# Altium schematic sheet FPGA.SchDoc
size D; SheetNumber: 1; SheetTotal: 1
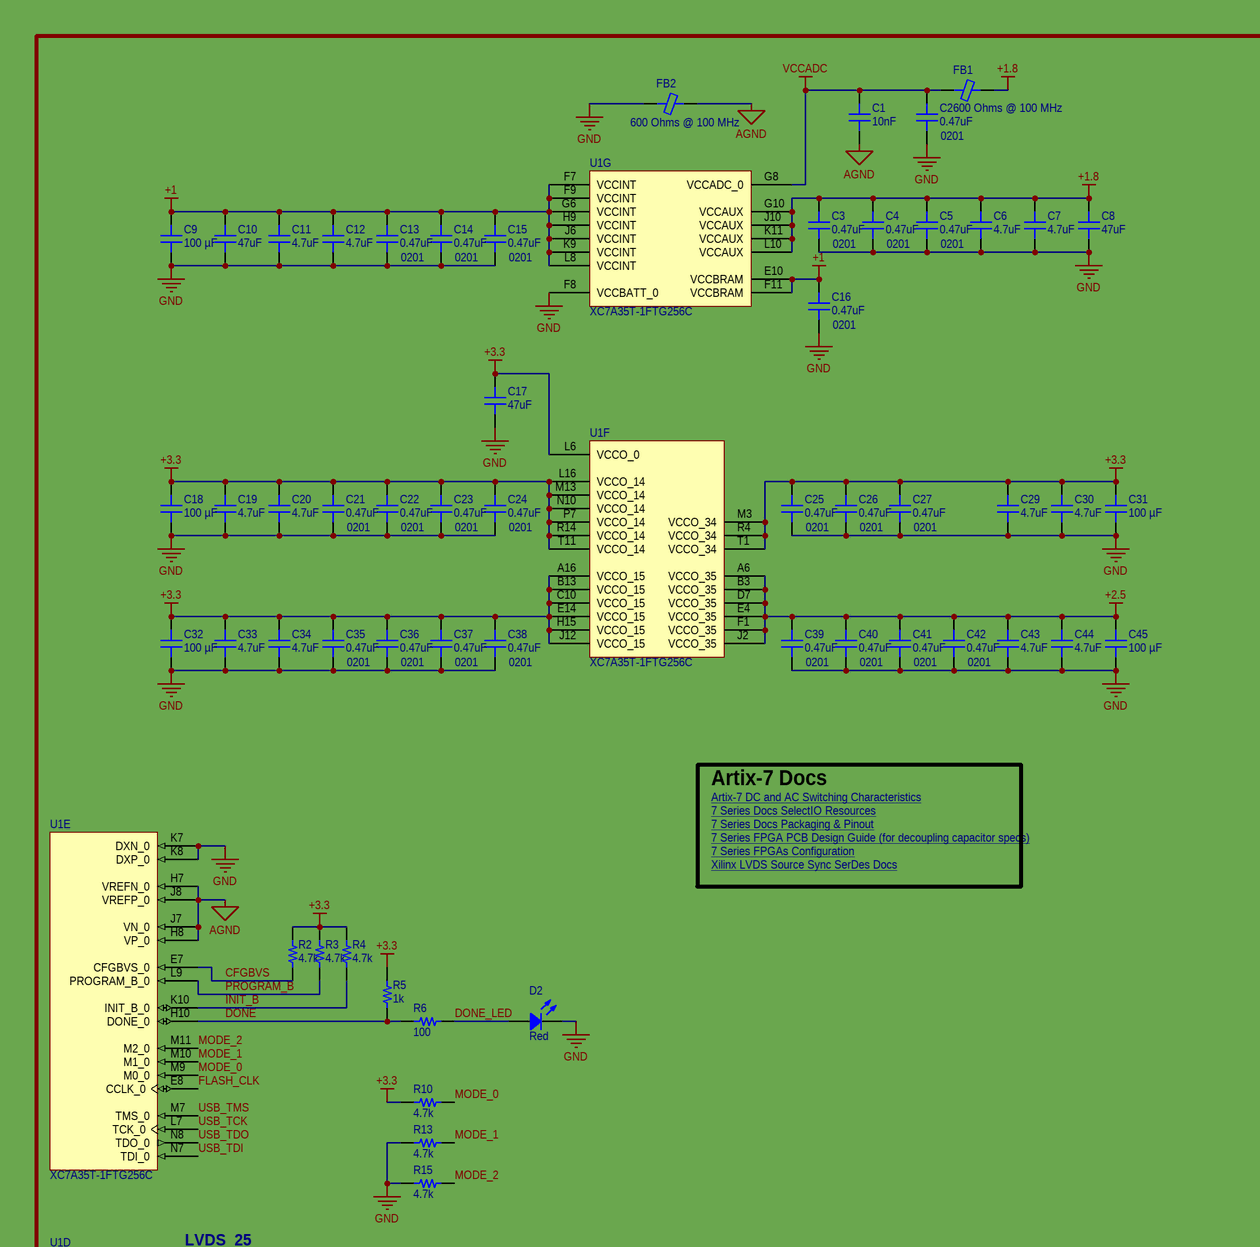
[diagram p0: FPGA.SchDoc, top left]
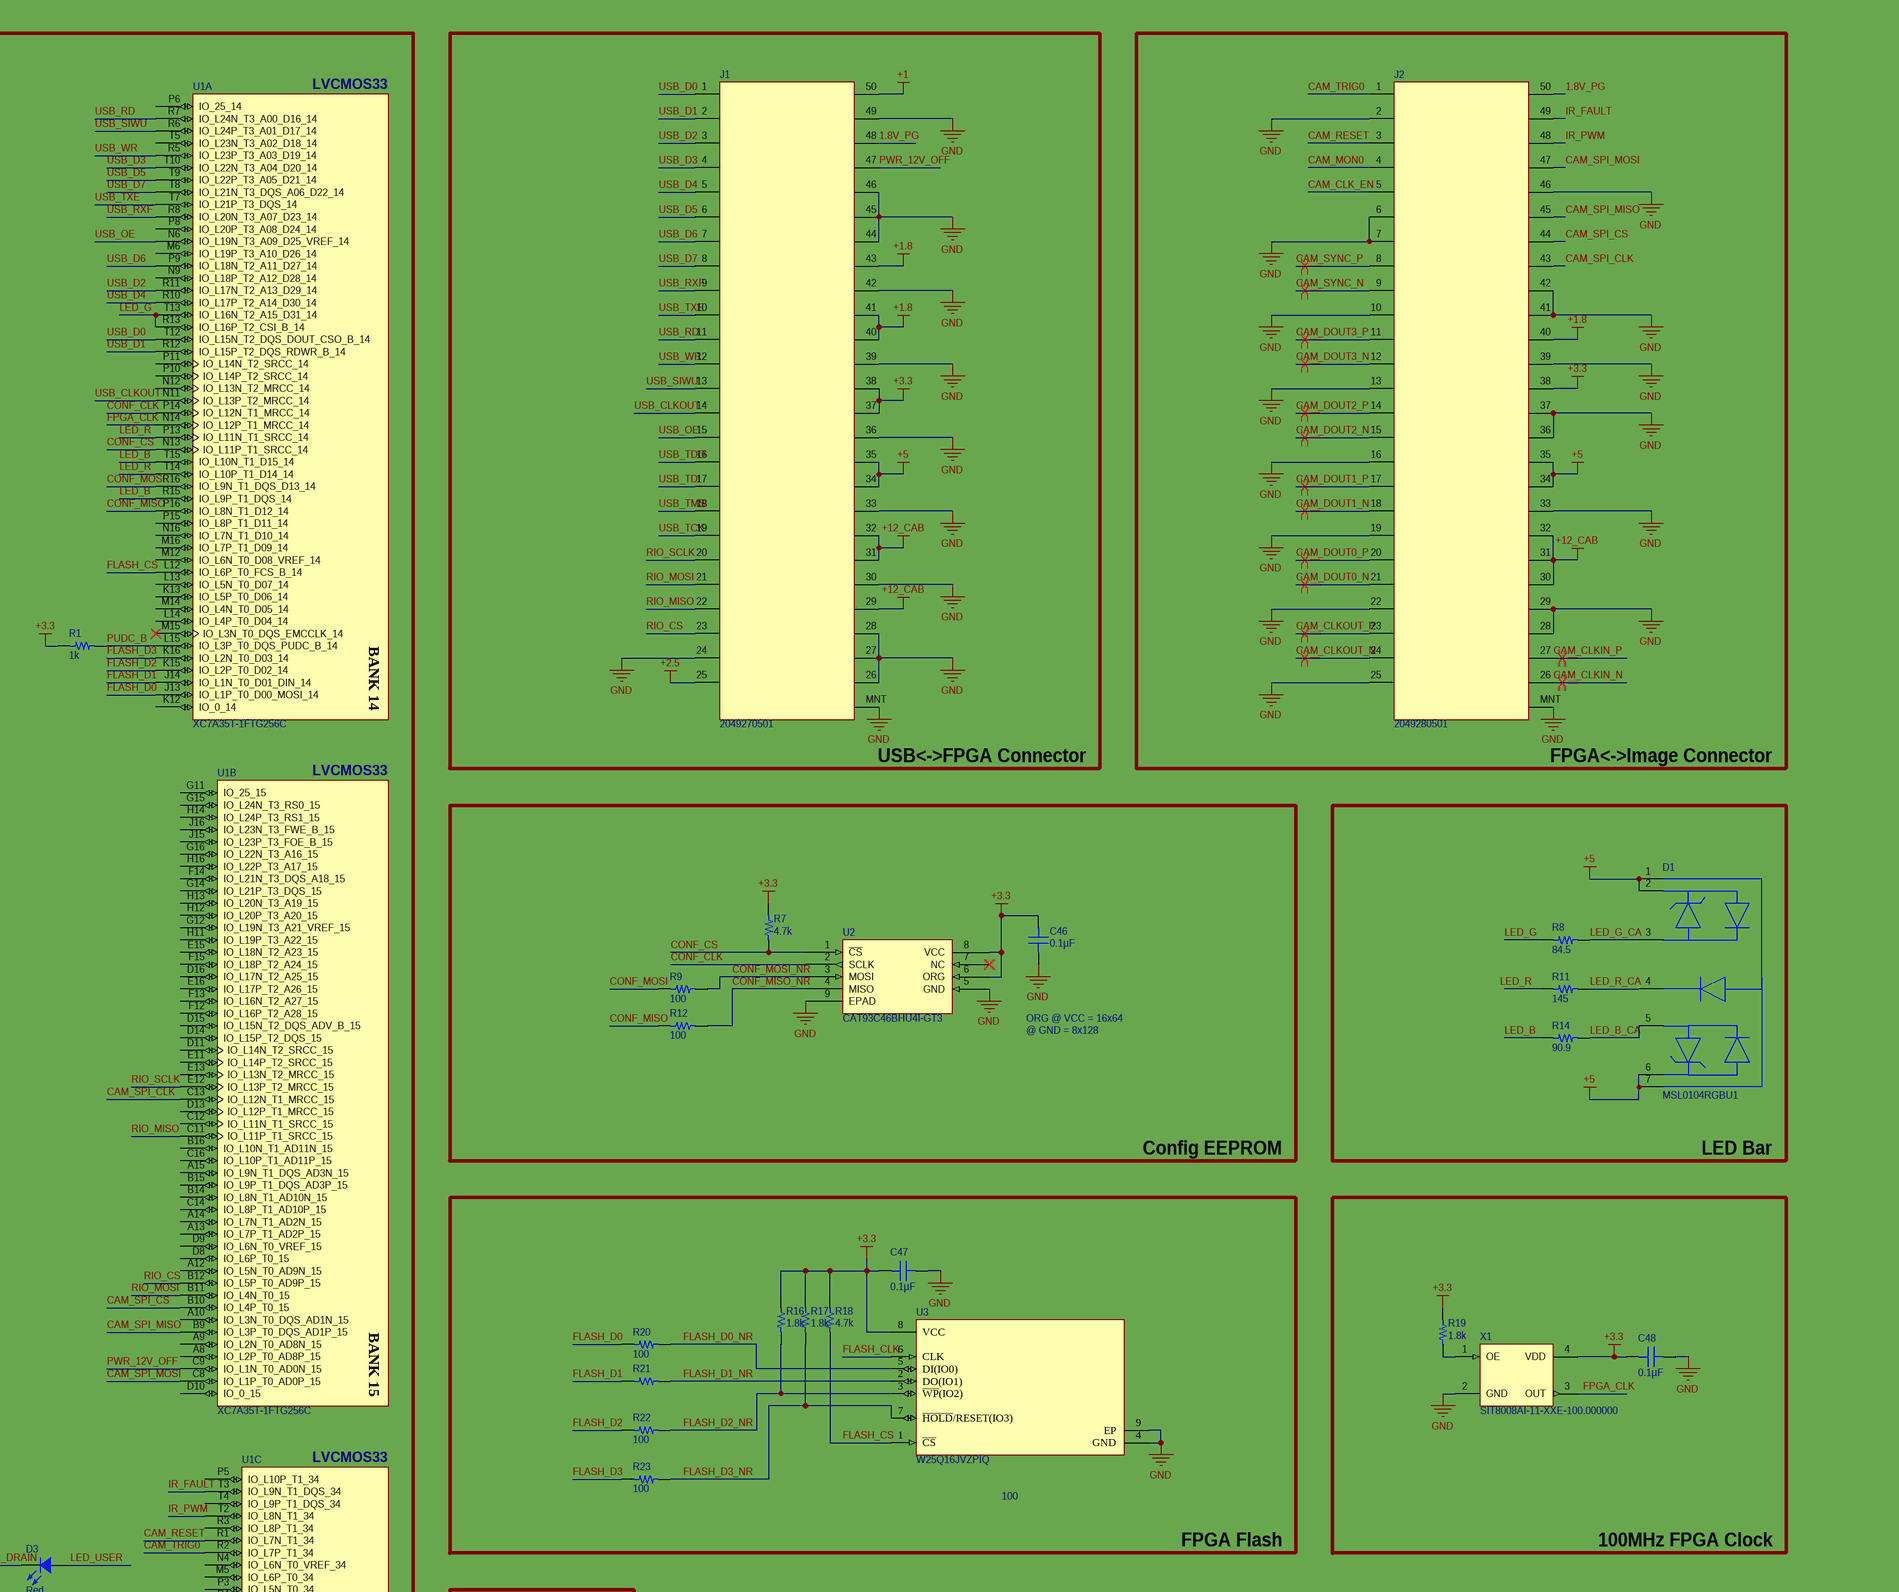
[diagram p1: FPGA.SchDoc, top middle]
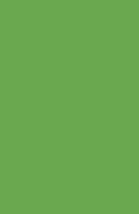
[diagram p2: FPGA.SchDoc, top right]
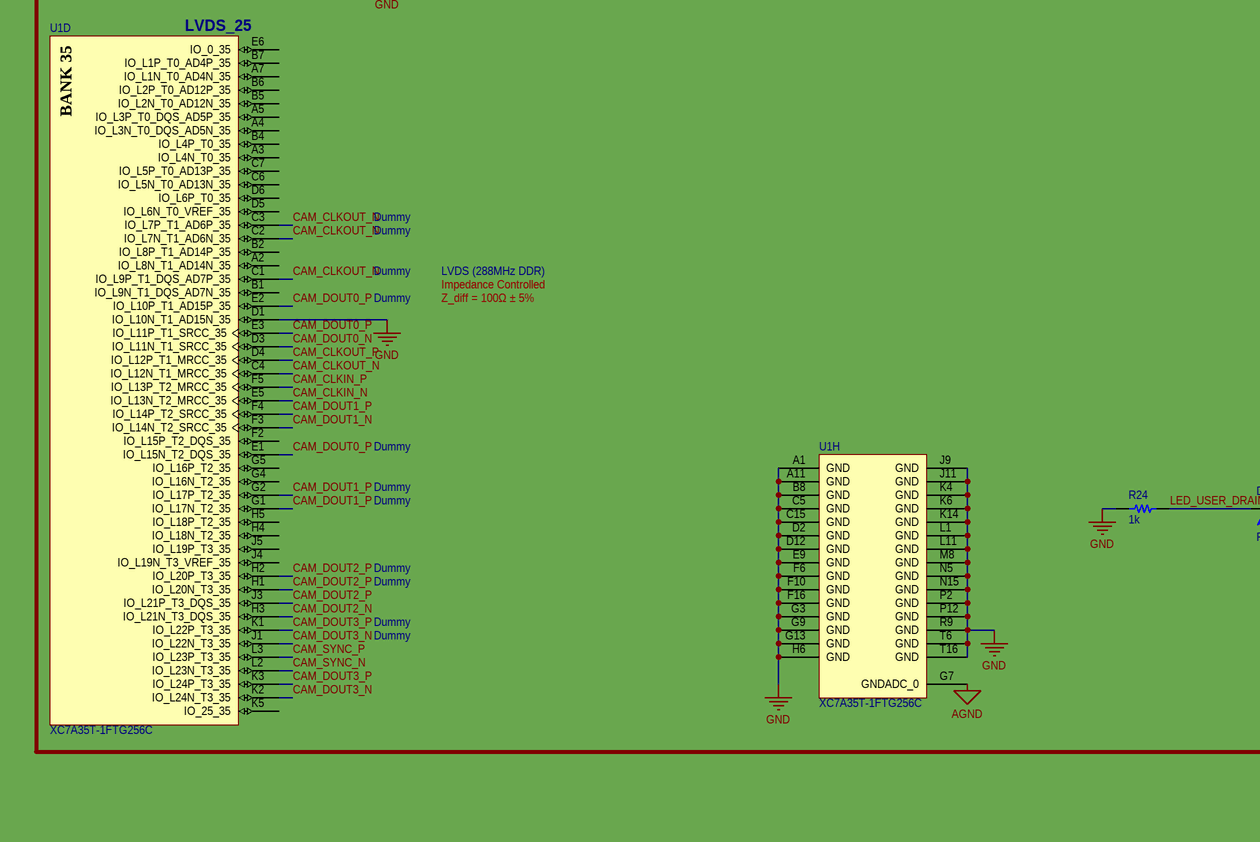
[diagram p3: FPGA.SchDoc, bottom left]
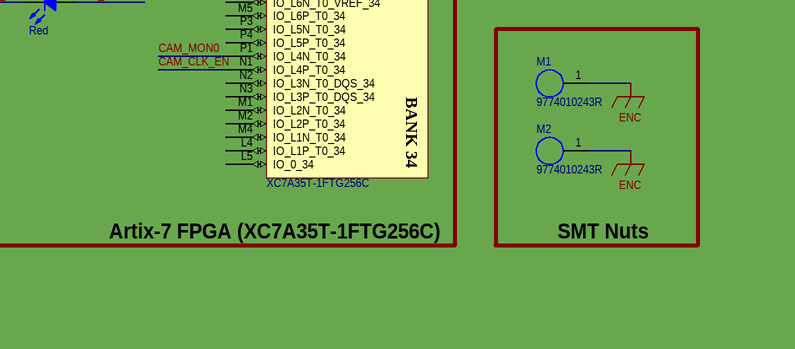
[diagram p4: FPGA.SchDoc, bottom middle]
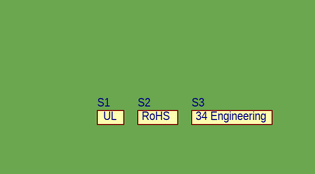
[diagram p5: FPGA.SchDoc, bottom right]

## Parts
C1  10nF  [CAP 0402_1005]
C2  0.47uF  Package / Case: 0201  [CAP 0201_0603]
C3  0.47uF  Package / Case: 0201  [CAP 0201_0603]
C4  0.47uF  Package / Case: 0201  [CAP 0201_0603]
C5  0.47uF  Package / Case: 0201  [CAP 0201_0603]
C6  4.7uF  [CAP 0402_1005]
C7  4.7uF  [CAP 0402_1005]
C8  47uF  [CAP 0603_1608]
C9  100 µF  [CAP 0805_2012]
C10  47uF  [CAP 0603_1608]
C11  4.7uF  [CAP 0402_1005]
C12  4.7uF  [CAP 0402_1005]
C13  0.47uF  Package / Case: 0201  [CAP 0201_0603]
C14  0.47uF  Package / Case: 0201  [CAP 0201_0603]
C15  0.47uF  Package / Case: 0201  [CAP 0201_0603]
C16  0.47uF  Package / Case: 0201  [CAP 0201_0603]
C17  47uF  [CAP 0603_1608]
C18  100 µF  [CAP 0805_2012]
C19  4.7uF  [CAP 0402_1005]
C20  4.7uF  [CAP 0402_1005]
C21  0.47uF  Package / Case: 0201  [CAP 0201_0603]
C22  0.47uF  Package / Case: 0201  [CAP 0201_0603]
C23  0.47uF  Package / Case: 0201  [CAP 0201_0603]
C24  0.47uF  Package / Case: 0201  [CAP 0201_0603]
C25  0.47uF  Package / Case: 0201  [CAP 0201_0603]
C26  0.47uF  Package / Case: 0201  [CAP 0201_0603]
C27  0.47uF  Package / Case: 0201  [CAP 0201_0603]
C29  4.7uF  [CAP 0402_1005]
C30  4.7uF  [CAP 0402_1005]
C31  100 µF  [CAP 0805_2012]
C32  100 µF  [CAP 0805_2012]
C33  4.7uF  [CAP 0402_1005]
C34  4.7uF  [CAP 0402_1005]
C35  0.47uF  Package / Case: 0201  [CAP 0201_0603]
C36  0.47uF  Package / Case: 0201  [CAP 0201_0603]
C37  0.47uF  Package / Case: 0201  [CAP 0201_0603]
C38  0.47uF  Package / Case: 0201  [CAP 0201_0603]
C39  0.47uF  Package / Case: 0201  [CAP 0201_0603]
C40  0.47uF  Package / Case: 0201  [CAP 0201_0603]
C41  0.47uF  Package / Case: 0201  [CAP 0201_0603]
C42  0.47uF  Package / Case: 0201  [CAP 0201_0603]
C43  4.7uF  [CAP 0402_1005]
C44  4.7uF  [CAP 0402_1005]
C45  100 µF  [CAP 0805_2012]
C46  0.1µF  [CAP 0402_1005]
C47  0.1µF  [CAP 0402_1005]
C48  0.1µF  [CAP 0402_1005]
D1  MSL0104RGBU1  [FP-MSL0104-MFG]
D2  Red  [LED 0603_1608 RED]
D3  Red  [LED 0603_1608 RED]
FB1  600 Ohms @ 100 MHz  [FER 0603_1608]
FB2  600 Ohms @ 100 MHz  [FER 0603_1608]
J1  2049270501  [2049270501]
J2  2049280501  [2049280501]
M1  9774010243R  [9774010243R]
M2  9774010243R  [9774010243R]
R1  1k  [RES 0402_1005]
R2  4.7k  [RES 0402_1005]
R3  4.7k  [RES 0402_1005]
R4  4.7k  [RES 0402_1005]
R5  1k  [RES 0402_1005]
R6  100  [RES 0402_1005]
R7  4.7k  [RES 0402_1005]
R8  84.5  [RES 0402_1005]
R9  100  [RES 0402_1005]
R10  4.7k  [RES 0402_1005]
R11  145  [RES 0402_1005]
R12  100  [RES 0402_1005]
R13  4.7k  [RES 0402_1005]
R14  90.9  [RES 0402_1005]
R15  4.7k  [RES 0402_1005]
R16  1.8k  [RES 0402_1005]
R17  1.8k  [RES 0402_1005]
R18  4.7k  [RES 0402_1005]
R19  1.8k  [RES 0402_1005]
R20  100  [RES 0402_1005]
R21  100  [RES 0402_1005]
R22  100  [RES 0402_1005]
R23  100  [RES 0402_1005]
R24  1k  [RES 0603_1608]
S1  (no value)  [UL]
S2  (no value)  [RoHS]
S3  (no value)  [34EngineeringLogo]
U1  XC7A35T-1FTG256C  [FTG256]  (parts A,B,C,D,E,F,G,H of 8)
U2  CAT93C46BHU4I-GT3  [CAT93C46BHU4I-GT3]
U3  W25Q16JVZPIQ  [FP-ZP-IPC_B]
X1  SIT8008AI-11-XXE-100.000000  [SIT8008AI-11-XXE-100.000000]

## Blocks framed on the sheet
USB<->FPGA Connector: J1
FPGA<->Image Connector: J2
Config EEPROM: C46 R7 R9 R12 U2
LED Bar: D1 R8 R11 R14
FPGA Flash: C47 R16-R18 R20-R23 U3
100MHz FPGA Clock: C48 R19 X1
SMT Nuts: M1 M2

## Nets
+1: C9.2 C10.2 C11.1 C12.1 C13.1 C14.1 C15.1 C16.2 J1.50 U1.E10(VCCBRAM) U1.F7(VCCINT) U1.F9(VCCINT) U1.F11(VCCBRAM) U1.G6(VCCINT) U1.H9(VCCINT) U1.J6(VCCINT) U1.K9(VCCINT) U1.L8(VCCINT)
+1.8: C3.2 C4.2 C5.2 C6.2 C7.2 C8.2 FB1.2 J1.40 J1.41 J1.43 J2.40 U1.G10(VCCAUX) U1.J10(VCCAUX) U1.K11(VCCAUX) U1.L10(VCCAUX)
+2.5: C39.2 C40.2 C41.2 C42.2 C43.2 C44.2 C45.2 J1.25 U1.A6(VCCO_35) U1.B3(VCCO_35) U1.D7(VCCO_35) U1.E4(VCCO_35) U1.F1(VCCO_35) U1.J2(VCCO_35)
+3.3: C17.2 C18.2 C19.1 C20.1 C21.1 C22.1 C23.1 C24.1 C25.2 C26.2 C27.2 C29.2 C30.2 C31.2 C32.2 C33.1 C34.1 C35.1 C36.1 C37.1 C38.1 C46.2 C47.2 C48.2 J1.37 J1.38 J2.38 R1.1 R2.2 R3.2 R4.2 R5.2 R7.2 R10.2 R16.2 R17.2 R18.2 R19.2 U1.A16(VCCO_15) U1.B13(VCCO_15) U1.C10(VCCO_15) U1.E14(VCCO_15) U1.H15(VCCO_15) U1.J12(VCCO_15) U1.L6(VCCO_0) U1.L16(VCCO_14) U1.M3(VCCO_34) U1.M13(VCCO_14) U1.N10(VCCO_14) U1.P7(VCCO_14) U1.R4(VCCO_34) U1.R14(VCCO_14) U1.T1(VCCO_34) U1.T11(VCCO_14) U2.6(ORG) U2.8(VCC) U3.8(VCC) X1.4(VDD)
+5: D1.1(R_A) D1.2(G_A) D1.6(B_A) D1.7(R_A) J1.34 J1.35 J2.34 J2.35
+12_CAB: J1.29 J1.31 J1.32 J2.30 J2.31 J2.32
AGND: C1.1 FB2.2 U1.G7(GNDADC_0) U1.H7(VREFN_0) U1.H8(VP_0) U1.J7(VN_0) U1.J8(VREFP_0)
ENC: M1.1 M2.1
GND: C2.1 C3.1 C4.1 C5.1 C6.1 C7.1 C8.1 C9.1 C10.1 C11.2 C12.2 C13.2 C14.2 C15.2 C16.1 C17.1 C18.1 C19.2 C20.2 C21.2 C22.2 C23.2 C24.2 C25.1 C26.1 C27.1 C29.1 C30.1 C31.1 C32.1 C33.2 C34.2 C35.2 C36.2 C37.2 C38.2 C39.1 C40.1 C41.1 C42.1 C43.1 C44.1 C45.1 C46.1 C47.1 C48.1 D2.2 FB2.1 J1.24 J1.26 J1.27 J1.28 J1.30 J1.33 J1.36 J1.39 J1.42 J1.44 J1.45 J1.46 J1.49 J1.MNT J2.2 J2.6 J2.7 J2.10 J2.13 J2.16 J2.19 J2.22 J2.25 J2.28 J2.29 J2.33 J2.36 J2.37 J2.39 J2.41 J2.42 J2.46 J2.MNT R13.2 R15.2 R24.2 U1.A1(GND) U1.A11(GND) U1.B8(GND) U1.C5(GND) U1.C15(GND) U1.D1(IO_L10N_T1_AD15N_35) U1.D2(GND) U1.D12(GND) U1.E9(GND) U1.F6(GND) U1.F8(VCCBATT_0) U1.F10(GND) U1.F16(GND) U1.G3(GND) U1.G9(GND) U1.G13(GND) U1.H6(GND) U1.J9(GND) U1.J11(GND) U1.K4(GND) U1.K6(GND) U1.K7(DXN_0) U1.K8(DXP_0) U1.K14(GND) U1.L1(GND) U1.L11(GND) U1.M8(GND) U1.N5(GND) U1.N15(GND) U1.P2(GND) U1.P12(GND) U1.R9(GND) U1.T6(GND) U1.T16(GND) U2.5(GND) U2.9(EPAD) U3.4(GND) U3.9(EP) X1.2(GND)
VCCADC: C1.2 C2.2 FB1.1 U1.G8(VCCADC_0)
1.8V_PG: J1.48 J2.50
CAM_CLK_EN: J2.5 U1.N1(IO_L4P_T0_34)
CAM_CLKIN_N: J2.26 U1.E5(IO_L13N_T2_MRCC_35)
CAM_CLKIN_P: J2.27 U1.F5(IO_L13P_T2_MRCC_35)
CAM_CLKOUT_N: J2.24 U1.C1(IO_L9P_T1_DQS_AD7P_35) U1.C2(IO_L7N_T1_AD6N_35) U1.C3(IO_L7P_T1_AD6P_35) U1.C4(IO_L12N_T1_MRCC_35)
CAM_CLKOUT_P: J2.23 U1.D4(IO_L12P_T1_MRCC_35)
CAM_DOUT0_N: J2.21 U1.D3(IO_L11N_T1_SRCC_35)
CAM_DOUT0_P: J2.20 U1.E1(IO_L15N_T2_DQS_35) U1.E2(IO_L10P_T1_AD15P_35) U1.E3(IO_L11P_T1_SRCC_35)
CAM_DOUT1_N: J2.18 U1.F3(IO_L14N_T2_SRCC_35)
CAM_DOUT1_P: J2.17 U1.F4(IO_L14P_T2_SRCC_35) U1.G1(IO_L17N_T2_35) U1.G2(IO_L17P_T2_35)
CAM_DOUT2_N: J2.15 U1.H3(IO_L21N_T3_DQS_35)
CAM_DOUT2_P: J2.14 U1.H1(IO_L20N_T3_35) U1.H2(IO_L20P_T3_35) U1.J3(IO_L21P_T3_DQS_35)
CAM_DOUT3_N: J2.12 U1.J1(IO_L22N_T3_35) U1.K2(IO_L24N_T3_35)
CAM_DOUT3_P: J2.11 U1.K1(IO_L22P_T3_35) U1.K3(IO_L24P_T3_35)
CAM_MON0: J2.4 U1.P1(IO_L4N_T0_34)
CAM_RESET: J2.3 U1.R1(IO_L7N_T1_34)
CAM_SPI_CLK: J2.43 U1.C13(IO_L12N_T1_MRCC_15)
CAM_SPI_CS: J2.44 U1.B10(IO_L4P_T0_15)
CAM_SPI_MISO: J2.45 U1.B9(IO_L3P_T0_DQS_AD1P_15)
CAM_SPI_MOSI: J2.47 U1.C8(IO_L1P_T0_AD0P_15)
CAM_SYNC_N: J2.9 U1.L2(IO_L23N_T3_35)
CAM_SYNC_P: J2.8 U1.L3(IO_L23P_T3_35)
CAM_TRIG0: J2.1 U1.R2(IO_L7P_T1_34)
CFGBVS: R2.1 U1.E7(CFGBVS_0)
CONF_CLK: U1.P14(IO_L12N_T1_MRCC_14) U2.2(SCLK)
CONF_CS: R7.1 U1.N13(IO_L11P_T1_SRCC_14) U2.1(~{CS})
CONF_MISO: R12.2 U1.P16(IO_L8N_T1_D12_14)
CONF_MISO_NR: R12.1 U2.4(MISO)
CONF_MOSI: R9.2 U1.R16(IO_L9N_T1_DQS_D13_14)
CONF_MOSI_NR: R9.1 U2.3(MOSI)
DONE: R5.1 R6.2 U1.H10(DONE_0)
DONE_LED: D2.1 R6.1
FLASH_CLK: U1.E8(CCLK_0) U3.6(CLK)
FLASH_CS: R18.1 U1.L12(IO_L6P_T0_FCS_B_14) U3.1(~{CS})
FLASH_D0: R20.2 U1.J13(IO_L1P_T0_D00_MOSI_14)
FLASH_D0_NR: R20.1 U3.5(DI(IO0))
FLASH_D1: R21.1 U1.J14(IO_L1N_T0_D01_DIN_14)
FLASH_D1_NR: R21.2 U3.2(DO(IO1))
FLASH_D2: R22.2 U1.K15(IO_L2P_T0_D02_14)
FLASH_D2_NR: R16.1 R22.1 U3.3(~{WP}(IO2))
FLASH_D3: R23.2 U1.K16(IO_L2N_T0_D03_14)
FLASH_D3_NR: R17.1 R23.1 U3.7(~{HOLD}/RESET(IO3))
FPGA_CLK: U1.N14(IO_L12P_T1_MRCC_14) X1.3(OUT)
INIT_B: R4.1 U1.K10(INIT_B_0)
IR_FAULT: J2.49 U1.T3(IO_L9N_T1_DQS_34)
IR_PWM: J2.48 U1.T2(IO_L8N_T1_34)
LED_B: R14.1 U1.R15(IO_L9P_T1_DQS_14) U1.T15(IO_L10N_T1_D15_14)
LED_B_CA: D1.5(B_K) R14.2
LED_G: R8.1 U1.R13(IO_L16P_T2_CSI_B_14) U1.T13(IO_L16N_T2_A15_D31_14)
LED_G_CA: D1.3(G_K) R8.2
LED_R: R11.1 U1.P13(IO_L11N_T1_SRCC_14) U1.T14(IO_L10P_T1_D14_14)
LED_R_CA: D1.4(R_K) R11.2
LED_USER: D3.1
LED_USER_DRAIN: D3.2 R24.1
MODE_0: R10.1 U1.M9(M0_0)
MODE_1: R13.1 U1.M10(M1_0)
MODE_2: R15.1 U1.M11(M2_0)
PROGRAM_B: R3.1 U1.L9(PROGRAM_B_0)
PUDC_B: R1.2 U1.L15(IO_L3P_T0_DQS_PUDC_B_14)
PWR_12V_OFF: J1.47 U1.C9(IO_L1N_T0_AD0N_15)
RIO_CS: J1.23 U1.B12(IO_L5P_T0_AD9P_15)
RIO_MISO: J1.22 U1.C11(IO_L11P_T1_SRCC_15)
RIO_MOSI: J1.21 U1.B11(IO_L4N_T0_15)
RIO_SCLK: J1.20 U1.E12(IO_L13P_T2_MRCC_15)
USB_CLKOUT: J1.14 U1.N11(IO_L13P_T2_MRCC_14)
USB_D0: J1.1 U1.T12(IO_L15N_T2_DQS_DOUT_CSO_B_14)
USB_D1: J1.2 U1.R12(IO_L15P_T2_DQS_RDWR_B_14)
USB_D2: J1.3 U1.R11(IO_L17N_T2_A13_D29_14)
USB_D3: J1.4 U1.T10(IO_L22N_T3_A04_D20_14)
USB_D4: J1.5 U1.R10(IO_L17P_T2_A14_D30_14)
USB_D5: J1.6 U1.T9(IO_L22P_T3_A05_D21_14)
USB_D6: J1.7 U1.P9(IO_L18N_T2_A11_D27_14)
USB_D7: J1.8 U1.T8(IO_L21N_T3_DQS_A06_D22_14)
USB_OE: J1.15 U1.N6(IO_L19N_T3_A09_D25_VREF_14)
USB_RD: J1.11 U1.R7(IO_L24N_T3_A00_D16_14)
USB_RXF: J1.9 U1.R8(IO_L20N_T3_A07_D23_14)
USB_SIWU: J1.13 U1.R6(IO_L24P_T3_A01_D17_14)
USB_TCK: J1.19 U1.L7(TCK_0)
USB_TDI: J1.17 U1.N7(TDI_0)
USB_TDO: J1.16 U1.N8(TDO_0)
USB_TMS: J1.18 U1.M7(TMS_0)
USB_TXE: J1.10 U1.T7(IO_L21P_T3_DQS_14)
USB_WR: J1.12 U1.R5(IO_L23P_T3_A03_D19_14)
NetR19_1: R19.1 X1.1(OE)

Not connected (* = marked no-connect by the designer): U1 A2(IO_L8N_T1_AD14N_35) A3(IO_L4N_T0_35) A4(IO_L3N_T0_DQS_AD5N_35) A5(IO_L3P_T0_DQS_AD5P_35) A7(IO_L1N_T0_AD4N_35) A8(IO_L2P_T0_AD8P_15) A9(IO_L2N_T0_AD8N_15) A10(IO_L3N_T0_DQS_AD1N_15) A12(IO_L5N_T0_AD9N_15) A13(IO_L7P_T1_AD2P_15) A14(IO_L7N_T1_AD2N_15) A15(IO_L9N_T1_DQS_AD3N_15) B1(IO_L9N_T1_DQS_AD7N_35) B2(IO_L8P_T1_AD14P_35) B4(IO_L4P_T0_35) B5(IO_L2N_T0_AD12N_35) B6(IO_L2P_T0_AD12P_35) B7(IO_L1P_T0_AD4P_35) B14(IO_L8N_T1_AD10N_15) B15(IO_L9P_T1_DQS_AD3P_15) B16(IO_L10N_T1_AD11N_15) C6(IO_L5N_T0_AD13N_35) C7(IO_L5P_T0_AD13P_35) C12(IO_L11N_T1_SRCC_15) C14(IO_L8P_T1_AD10P_15) C16(IO_L10P_T1_AD11P_15) D5(IO_L6N_T0_VREF_35) D6(IO_L6P_T0_35) D8(IO_L6P_T0_15) D9(IO_L6N_T0_VREF_15) D10(IO_0_15) D11(IO_L14N_T2_SRCC_15) D13(IO_L12P_T1_MRCC_15) D14(IO_L15P_T2_DQS_15) D15(IO_L15N_T2_DQS_ADV_B_15) D16(IO_L17N_T2_A25_15) E6(IO_0_35) E11(IO_L14P_T2_SRCC_15) E13(IO_L13N_T2_MRCC_15) E15(IO_L18N_T2_A23_15) E16(IO_L17P_T2_A26_15) F2(IO_L15P_T2_DQS_35) F12(IO_L16P_T2_A28_15) F13(IO_L16N_T2_A27_15) F14(IO_L21N_T3_DQS_A18_15) F15(IO_L18P_T2_A24_15) G4(IO_L16N_T2_35) G5(IO_L16P_T2_35) G11(IO_25_15) G12(IO_L19N_T3_A21_VREF_15) G14(IO_L21P_T3_DQS_15) G15(IO_L24N_T3_RS0_15) G16(IO_L22N_T3_A16_15) H4(IO_L18N_T2_35) H5(IO_L18P_T2_35) H11(IO_L19P_T3_A22_15) H12(IO_L20P_T3_A20_15) H13(IO_L20N_T3_A19_15) H14(IO_L24P_T3_RS1_15) H16(IO_L22P_T3_A17_15) J4(IO_L19N_T3_VREF_35) J5(IO_L19P_T3_35) J15(IO_L23P_T3_FOE_B_15) J16(IO_L23N_T3_FWE_B_15) K5(IO_25_35) K12(IO_0_14) K13(IO_L5P_T0_D06_14) L4(IO_L1P_T0_34) L5(IO_0_34) L13(IO_L5N_T0_D07_14) L14(IO_L4P_T0_D04_14) M1(IO_L2N_T0_34) M2(IO_L2P_T0_34) M4(IO_L1N_T0_34) M5(IO_L6P_T0_34) M6(IO_L19P_T3_A10_D26_14) M12(IO_L6N_T0_D08_VREF_14) M14(IO_L4N_T0_D05_14) M15(IO_L3N_T0_DQS_EMCCLK_14)* M16(IO_L7P_T1_D09_14) N2(IO_L3N_T0_DQS_34) N3(IO_L3P_T0_DQS_34) N4(IO_L6N_T0_VREF_34) N9(IO_L18P_T2_A12_D28_14) N12(IO_L13N_T2_MRCC_14) N16(IO_L7N_T1_D10_14) P3(IO_L5N_T0_34) P4(IO_L5P_T0_34) P5(IO_L10P_T1_34) P6(IO_25_14) P8(IO_L20P_T3_A08_D24_14) P10(IO_L14P_T2_SRCC_14) P11(IO_L14N_T2_SRCC_14) P15(IO_L8P_T1_D11_14) R3(IO_L8P_T1_34) T4(IO_L9P_T1_DQS_34) T5(IO_L23N_T3_A02_D18_14); U2 7(NC)*

## Layout directives
differential pair; differential pair class CAM_DOUT1; rule Signal Stimulus [Kind - Single Pulse    Level - High    Start Time = 0.000    Stop Time = 1.389n    Period Time = 2.778n]: CAM_DOUT1_N, CAM_DOUT1_P
differential pair; differential pair class CAM_DOUT2; rule Signal Stimulus [Kind - Single Pulse    Level - High    Start Time = 0.000    Stop Time = 1.389n    Period Time = 2.778n]: CAM_DOUT2_N, CAM_DOUT2_P
differential pair; differential pair class CAM_DOUT3; rule Signal Stimulus [Kind - Single Pulse    Level - High    Start Time = 0.000    Stop Time = 1.389n    Period Time = 2.778n]: CAM_DOUT3_N, CAM_DOUT3_P
differential pair; differential pair class CAM_SYNC; rule Signal Stimulus [Kind - Single Pulse    Level - High    Start Time = 0.000    Stop Time = 1.389n    Period Time = 2.778n]: CAM_SYNC_N, CAM_SYNC_P
differential pair; differential pair class CAM_CLKOUT; rule Signal Stimulus [Kind - Single Pulse    Level - High    Start Time = 0.000    Stop Time = 1.389n    Period Time = 2.778n]: CAM_CLKOUT_N, CAM_CLKOUT_P
differential pair; differential pair class CAM_DOUT0; rule Signal Stimulus [Kind - Single Pulse    Level - High    Start Time = 0.000    Stop Time = 1.389n    Period Time = 2.778n]: CAM_DOUT0_N, CAM_DOUT0_P
differential pair; differential pair class CAM_CLKIN; rule Signal Stimulus [Kind - Single Pulse    Level - High    Start Time = 0.000    Stop Time = 1.389n    Period Time = 2.778n]: CAM_CLKIN_N, CAM_CLKIN_P

## Notes on the sheet
- LVCMOS33
- Artix-7 Docs
- 7 Series Docs Packaging & Pinout <https://www.xilinx.com/support/documentation/user_guides/ug475_7Series_Pkg_Pinout.pdf>
- 7 Series Docs SelectIO Resources <https://www.xilinx.com/support/documentation/user_guides/ug471_7Series_SelectIO.pdf>
- Artix-7 DC and AC Switching Characteristics <https://www.xilinx.com/support/documentation/data_sheets/ds181_Artix_7_Data_Sheet.pdf>
- 7 Series FPGA PCB Design Guide (for decoupling capacitor specs) <https://www.xilinx.com/support/documentation/user_guides/ug483_7Series_PCB.pdf>
- 7 Series FPGAs Configuration <https://docs.xilinx.com/v/u/en-US/ug470_7Series_Config>
- Xilinx LVDS Source Sync SerDes Docs <https://www.xilinx.com/content/dam/xilinx/support/documentation/application_notes/xapp585-lvds-source-synch-serdes-clock-multiplication.pdf>
- ORG @ VCC = 16x64
- @ GND = 8x128
- (near U1) LVDS_25
- Dummy
- LVDS (288MHz DDR)
- Impedance Controlled
- Z_diff = 100Ω ± 5%
- Artix-7 FPGA (XC7A35T-1FTG256C)
- (in symbol 34EngineeringLogo) 34 Engineering
- (in symbol CMP-0383-00028-1, part A) BANK 14
- (in symbol CMP-0383-00028-1, part B) BANK 15
- (in symbol CMP-0383-00028-1, part C) BANK 34
- (in symbol CMP-0383-00028-1, part D) BANK 35

## Library data of the parts
C1 = 0402B103K6R3CT: CAP CER 10000PF 6.3V X7R 0402; manufacturer: Walsin Technology Corporation; Tolerance: ±10%; Part Number: 0402B103K6R3CT; Value: 10000 pF; Applications: General Purpose; Capacitance: 10000 pF; componentlink1description: Datasheet; componentlink1url: http://www.passivecomponent.com/wp-content/uploads/2018/10/MLCC.pdf; componentlink2description: DigiKey Link; componentlink2url: https://www.digikey.com/en/products/detail/walsin-technology-corporation/0402B103K6R3CT/9354671; Device Package: 0402 (1005 Metric); lastupdated: 7/10/2022 8:59:10 AM; Lifecycle Status: Active; Minimum Order: 1; Mounting Type: Surface Mount, MLCC; Operating Temperature: -55°C ~ 125°C; Package / Case: 0402 (1005 Metric); packaging: CutTape; partid: 11629; Part Status: Active; price: 0.01; series: -; Size / Dimension: 0.039" L x 0.020" W (1.00mm x 0.50mm); Supplier 1: DigiKey; Supplier Part Number 1: 1292-1173-1-ND; Temperature Coefficient: X7R; Thickness (Max): 0.022" (0.55mm); Voltage - Rated: 6.3V
C2-C5 C13-C16 C21-C27 C35-C42 = 02016D474KAT2A: CAP CER 0.47UF 6.3V X5R 0201; manufacturer: KYOCERA AVX; Value: 0.47 µF; Tolerance: ±10%; Part Number: 02016D474KAT2A; Applications: General Purpose; Capacitance: 0.47 µF; componentlink1description: Datasheet; componentlink1url: https://datasheets.kyocera-avx.com/cx5r.pdf; componentlink2description: DigiKey Link; componentlink2url: https://www.digikey.com/en/products/detail/kyocera-avx/02016D474KAT2A/7056645; Device Package: 0201 (0603 Metric); lastupdated: 7/10/2022 8:56:15 AM; Lifecycle Status: Active; Minimum Order: 1; Mounting Type: Surface Mount, MLCC; Operating Temperature: -55°C ~ 85°C; packaging: TapeAndReel; partid: 29809; Part Status: Active; price: 0.01; series: -; Size / Dimension: 0.024" L x 0.012" W (0.60mm x 0.30mm); Supplier 1: DigiKey; Supplier Part Number 1: 478-02016D474KAT2ACT-ND; Temperature Coefficient: X5R; Thickness (Max): 0.013" (0.33mm); Voltage - Rated: 6.3V
C6 C7 C11 C12 C19 C20 C29 C30 C33 C34 C43 C44 = 04026D475MAT2A: CAP CER 4.7UF 6.3V X5R 0402; manufacturer: AVX Corporation; Value: 4.7µF; Tolerance: ±20%; Part Number: 04026D475MAT2A; Applications: General Purpose; Capacitance: 4.7µF; componentlink1description: Datasheet; componentlink1url: http://datasheets.avx.com/cx5r.pdf; componentlink2description: DigiKey Link; componentlink2url: http://digikey.com/product-detail/en/avx-corporation/04026D475MAT2A/478-10071-1-ND/6564293; Device Package: 0402 (1005 Metric); lastupdated: 2/8/2022 12:26:39 PM; Lifecycle Status: Active; Minimum Order: 1; Mounting Type: Surface Mount, MLCC; Operating Temperature: -55°C ~ 85°C; Package / Case: 0402 (1005 Metric); packaging: TapeAndReel; partid: 12333; Part Status: Active; price: 0.04; series: -; Size / Dimension: 0.039" L x 0.020" W (1.00mm x 0.50mm); Supplier 1: DigiKey; Supplier Part Number 1: 478-10071-1-ND; Temperature Coefficient: X5R; Thickness (Max): 0.028" (0.71mm); Voltage - Rated: 6.3V
C8 C10 C17 = GRM188R60J476ME15D: CAP CER 47UF 6.3V X5R 0603; manufacturer: Murata Electronics; Value: 47 µF; Tolerance: ±20%; Part Number: GRM188R60J476ME15D; Applications: General Purpose; Capacitance: 47 µF; componentlink1description: Datasheet; componentlink1url: https://www.murata.com/~/media/webrenewal/support/library/catalog/products/capacitor/mlcc/c02e.ashx?la=en-us; componentlink2description: DigiKey Link; componentlink2url: https://www.digikey.com/en/products/detail/murata-electronics/GRM188R60J476ME15D/5877410; Device Package: 0603 (1608 Metric); lastupdated: 7/10/2022 9:02:58 AM; Lifecycle Status: Active; Minimum Order: 1; Mounting Type: Surface Mount, MLCC; Operating Temperature: -55°C ~ 85°C; Package / Case: 0603 (1608 Metric); packaging: TapeAndReel; partid: 5468; Part Status: Active; price: 0.11; series: GRM; Size / Dimension: 0.063" L x 0.031" W (1.60mm x 0.80mm); Supplier 1: DigiKey; Supplier Part Number 1: 490-13247-1-ND; Temperature Coefficient: X5R; Thickness (Max): 0.039" (1.00mm); Voltage - Rated: 6.3V
C9 C18 C31 C32 C45 = GRM21BR60J107ME15L: CAP CER 100UF 6.3V X5R 0805; manufacturer: Murata Electronics; Tolerance: ±20%; Part Number: GRM21BR60J107ME15L; Value: 100 µF; Applications: General Purpose; Capacitance: 100 µF; componentlink1description: Datasheet; componentlink1url: https://search.murata.co.jp/Ceramy/image/img/A01X/G101/ENG/GRM21BR60J107ME15-01.pdf; componentlink2description: DigiKey Link; componentlink2url: https://www.digikey.com/en/products/detail/murata-electronics/GRM21BR60J107ME15L/6155751; Device Package: 0805 (2012 Metric); lastupdated: 7/10/2022 9:05:31 AM; Lifecycle Status: Active; Minimum Order: 1; Mounting Type: Surface Mount, MLCC; Operating Temperature: -55°C ~ 85°C; Package / Case: 0805 (2012 Metric); packaging: TapeAndReel; partid: 39849; Part Status: Active; price: 0.42; series: GRM; Size / Dimension: 0.079" L x 0.049" W (2.00mm x 1.25mm); Supplier 1: DigiKey; Supplier Part Number 1: 490-13981-1-ND; Temperature Coefficient: X5R; Thickness (Max): 0.057" (1.45mm); Voltage - Rated: 6.3V
C46-C48 = 0402ZC104KAT2A: CAP CER 0.1UF 10V X7R 0402; manufacturer: AVX Corporation; Tolerance: ±10%; Part Number: 0402ZC104KAT2A; Value: 0.1µF; Applications: General Purpose; Capacitance: 0.1µF; componentlink1description: Datasheet; componentlink1url: http://datasheets.avx.com/X7RDielectric.pdf; componentlink2description: DigiKey Link; componentlink2url: http://digikey.com/product-detail/en/avx-corporation/0402ZC104KAT2A/478-7891-1-ND/3881514; Device Package: 0402 (1005 Metric); lastupdated: 2/8/2022 12:26:59 PM; Lifecycle Status: Active; Minimum Order: 1; Mounting Type: Surface Mount, MLCC; Operating Temperature: -55°C ~ 125°C; Package / Case: 0402 (1005 Metric); packaging: TapeAndReel; partid: 1757; Part Status: Active; price: 0.09; series: -; Size / Dimension: 0.039" L x 0.020" W (1.00mm x 0.50mm); Supplier 1: DigiKey; Supplier Part Number 1: 478-7891-1-ND; Temperature Coefficient: X7R; Thickness (Max): 0.022" (0.55mm); Voltage - Rated: 10V
D1 = CMP-08952-000007-1: LED RGB DIFFUSED 2709 SMD R/A; Manufacturer: Rohm; Forward Current: 20mA; Forward Voltage: 2.1/3.3/3.2V; Luminous Intensity: 700/1200/400mcd; Power Dissipation: 400mW; Automotive Grade: NA; Colour: Red, Green, Blue; Wavelength: 624/527/470nm; Led Orientation: Side View; Device Class L2: LEDs; Mouser Description: Standard LEDs - SMD RGB 624/527/470nm 700/1200/400mcd; Lead Free: Yes; Package: MSL0104; RoHS: TRUE; Device Class L3: unset; Manufacturer Part Number: MSL0104RGBU1; Automotive: No; Octopart: https://octopart.com/msl0104rgbu1-rohm-71139759; Temperature Range High: +85°C; ComponentLink2URL: https://www.rohm.com/datasheet/MSL0104RGBU/msl0104rgb-e; ComponentLink2Description: Datasheet; Category: Diode; Temperature: -40°C to +85°C; Temperature Range Low: -40°C; Height: 2.35mm; Digikey Description: LED RGB DIFFUSED 2709 SMD R/A; Device Class L1: Optoelectronics
D2 D3 = SML-D12U1WT86: LED RED DIFFUSED 1608 SMD; Manufacturer: Rohm Semiconductor; Configuration: Standard; Current - Test: 20mA; Lens Color: White; Lens Size: 1.20mm x 0.80mm; Lens Style: Rectangle with Flat Top; Millicandela Rating: 63mcd; Voltage - Forward (Vf) (Typ): 2.2V; Wavelength - Dominant: 620nm; Part Number: SML-D12U1WT86; Color: Red; ComponentLink1Description: Datasheet; ComponentLink1URL: https://www.rohm.com/datasheet/SML-D12U1W; ComponentLink2Description: DigiKey Link; ComponentLink2URL: https://www.digikey.com/en/products/detail/rohm-semiconductor/SML-D12U1WT86/5843853; Device Package: 0603 (1608 Metric); Height (Max): 0.65mm; LastUpdated: 7/10/2022 9:48:39 AM; Lens Transparency: Diffused; Lifecycle Status: Active; Minimum Order: 1; Mounting Type: Surface Mount; Package / Case: 0603 (1608 Metric); Packaging: TapeAndReel; PartId: 452; Part Status: Active; Price: 0.02; Series: SML-D12; Size / Dimension: 1.60mm L x 0.80mm W; Supplier 1: DigiKey; Supplier Part Number 1: SML-D12U1WT86CT-ND; Supplier Device Package: 1608 (0603); Value: Red
FB1 FB2 = BLM18AG601SN1D: FERRITE BEAD 600 OHM 0603 1LN; Manufacturer: Murata Electronics; Current Rating (Max): 500mA; DC Resistance (DCR) (Max): 380mOhm; Number of Lines: 1; Part Number: BLM18AG601SN1D; ComponentLink1Description: Datasheet; ComponentLink1URL: https://www.murata.com/en-us/products/productdata/8796738650142/ENFA0003.pdf; ComponentLink2Description: DigiKey Link; ComponentLink2URL: https://www.digikey.com/en/products/detail/murata-electronics/BLM18AG601SN1D/584225; Device Package: 0603 (1608 Metric); Height (Max): 0.037" (0.95mm); Impedance @ Frequency: 600 Ohms @ 100 MHz; LastUpdated: 7/10/2022 9:43:27 AM; Lifecycle Status: Active; Minimum Order: 1; Mounting Type: Surface Mount; Operating Temperature: -55°C ~ 125°C; Package / Case: 0603 (1608 Metric); Packaging: TapeAndReel; PartId: 848; Part Status: Active; Price: 0.02; Series: EMIFIL®, BLM18; Size / Dimension: 0.063" L x 0.032" W (1.60mm x 0.80mm); Supplier 1: DigiKey; Supplier Part Number 1: 490-1014-1-ND; Value: 600 Ohms @ 100 MHz
J1 = 2049270501: SlimStack Board-to-Board Receptacle, 0.40mm Pitch, FSB3 Floating Series, 3.00mm Mated Height, 3.20mm Mated Width, 50...; Manufacturer: Molex; Manufacturer Part Number: 203955-0503; RoHS: No; Stock 1: 8587; Pricing 1: 1=3.72000, 10=3.28000, 50=3.28000, 100=2.61000, 1000=2.16000, 10000=2.01000 (USD); Supplier 1: Mouser; Supplier Part Number 1: 538-204927-0501
J2 = 2049280501: SlimStack Board-to-Board Plug, 0.40mm Pitch, FSB3 Floating Series, 3.00mm Mated Height, 3.20 Mated Width, 50 Circuits; Manufacturer: Molex; Manufacturer Part Number: 203955-0503; RoHS: No; Stock 1: 8554; Pricing 1: 1=4.46000, 10=3.93000, 50=3.93000, 100=3.13000, 500=3.04000, 1000=2.59000, 3000=2.41000, 6000=2.32000, 9000=2.23000, 10000=2.41000 (USD); Supplier 1: Mouser; Supplier Part Number 1: 538-204928-0501
M1 M2 = 9774010243R: Spacer Material: Steel, Tin-Plated Mounting: SMT Series: WA-SMST Thread D: M2; Manufacturer: Wurth Electronics; Manufacturer Part Number: 9774070960R; Plating: Tin; Threaded/Unthreaded: Unthreaded; Inside Diameter: 0.13inch; Outside Diameter: 0.236inch; RoHS: Yes; Category: Spacers, Standoffs; Stock 1: 946; Pricing 1: 1=1.24000, 10=1.18000, 25=1.11000, 50=1.05000, 100=0.95600 (USD); Material: Steel; Length: 0.33inch; REACH SVHC: Unknown; ComponentLink1URL: http://www.mouser.com/ds/2/445/9774070960R-611130.pdf?src-supplier=Mouser; ComponentLink1Description: http://www.mouser.com/ds/2/445/9774070960R-611130.pdf?src-supplier=Mouser; ComponentLink2URL: http://www.farnell.com/datasheets/1960400.pdf?src-supplier=Farnell; ComponentLink2Description: http://www.farnell.com/datasheets/1960400.pdf?src-supplier=Farnell; ComponentLink3URL: https://media.digikey.com/pdf/Data%20Sheets/Wurth%20Electronics%20PDFs/WA-SMSx_Performance_Flyer.pdf?src-supplier=Digi-Key; ComponentLink3Description: https://media.digikey.com/pdf/Data%20Sheets/Wurth%20Electronics%20PDFs/WA-SMSx_Performance_Flyer.pdf?src-supplier=Digi-Key; ComponentLink4URL: http://www.farnell.com/datasheets/1960400.pdf?src-supplier=Newark; ComponentLink4Description: http://www.farnell.com/datasheets/1960400.pdf?src-supplier=Newark; ComponentLink5URL: http://www.farnell.com/datasheets/1960400.pdf?src-supplier=Element14; ComponentLink5Description: http://www.farnell.com/datasheets/1960400.pdf?src-supplier=Element14; Stock 2: 1; Pricing 2: 650=0.83200, 1300=0.79000 (USD); ComponentLink6URL: http://www.mouser.com/ds/2/445/9774110960R-611133.pdf?src-supplier=Mouser; ComponentLink6Description: http://www.mouser.com/ds/2/445/9774110960R-611133.pdf?src-supplier=Mouser; ComponentLink7URL: http://www.farnell.com/datasheets/1960407.pdf?src-supplier=Farnell; ComponentLink7Description: http://www.farnell.com/datasheets/1960407.pdf?src-supplier=Farnell; ComponentLink8URL: http://www.farnell.com/datasheets/1960407.pdf?src-supplier=Element14; ComponentLink8Description: http://www.farnell.com/datasheets/1960407.pdf?src-supplier=Element14; ComponentLink9URL: http://www.farnell.com/datasheets/1960396.pdf?src-supplier=Farnell; ComponentLink9Description: http://www.farnell.com/datasheets/1960396.pdf?src-supplier=Farnell; ComponentLink10URL: http://www.mouser.com/ds/2/445/9774050960R-611117.pdf?src-supplier=Mouser; ComponentLink10Description: http://www.mouser.com/ds/2/445/9774050960R-611117.pdf?src-supplier=Mouser; ComponentLink11URL: http://www.farnell.com/datasheets/1960396.pdf?src-supplier=Element14; ComponentLink11Description: http://www.farnell.com/datasheets/1960396.pdf?src-supplier=Element14; ComponentLink12URL: http://www.farnell.com/datasheets/1960396.pdf?src-supplier=Newark; ComponentLink12Description: http://www.farnell.com/datasheets/1960396.pdf?src-supplier=Newark; Supplier 1: Newark; ComponentLink13URL: http://www.farnell.com/datasheets/1960359.pdf?src-supplier=Farnell; ComponentLink13Description: http://www.farnell.com/datasheets/1960359.pdf?src-supplier=Farnell; ComponentLink14URL: http://www.mouser.com/ds/2/445/9774010243R-611450.pdf?src-supplier=Mouser; ComponentLink14Description: http://www.mouser.com/ds/2/445/9774010243R-611450.pdf?src-supplier=Mouser; ComponentLink15URL: http://www.farnell.com/datasheets/1960359.pdf?src-supplier=Element14; ComponentLink15Description: http://www.farnell.com/datasheets/1960359.pdf?src-supplier=Element14; ComponentLink16URL: http://www.farnell.com/datasheets/1960359.pdf?src-supplier=Newark; ComponentLink16Description: http://www.farnell.com/datasheets/1960359.pdf?src-supplier=Newark; Supplier Part Number 1: 59Y8415
R1 = RQ73C1E1K0BTD: RES 1 KOHMS 0.1% 1/16W 0402; Manufacturer: TE Connectivity Passive Product; Value: 1 kOhms; Power (Watts): 0.063W, 1/16W; Temperature Coefficient: ±10ppm/°C; Part Number: RQ73C1E1K0BTD; ComponentLink1Description: Datasheet; ComponentLink1URL: //media.digikey.com/pdf/Data%20Sheets/Tyco%20Electronics%20P%20B%20PDFs/RQ73-0618%20v2.pdf; ComponentLink2Description: DigiKey Link; ComponentLink2URL: https://www.digikey.com/en/products/detail/te-connectivity-passive-product/RQ73C1E1K0BTD/9479889; Composition: Thin Film; Device Package: 0402 (1005 Metric); Features: Anti-Sulfur, Automotive AEC-Q200; Height - Seated (Max): 0.016" (0.40mm); LastUpdated: 7/10/2022 9:15:05 AM; Lifecycle Status: Active; Minimum Order: 1; Number of Terminations: 2; Operating Temperature: -55°C ~ 155°C; Package / Case: 0402 (1005 Metric); Packaging: TapeAndReel; PartId: 3061; Part Status: Active; Price: 0.28; Ratings: AEC-Q200; Resistance: 1 kOhms; Series: RQ73; Size / Dimension: 0.039" L x 0.020" W (1.00mm x 0.50mm); Supplier 1: DigiKey; Supplier Part Number 1: A139941CT-ND; Supplier Device Package: 0402; Tolerance: ±0.1%
R2-R4 R7 R10 R13 R15 R18 = RMCF0402FT4K70: RES 4.7K OHM 1% 1/16W 0402; Manufacturer: Stackpole Electronics Inc; Value: 4.7 kOhms; Power (Watts): 0.063W, 1/16W; Temperature Coefficient: ±100ppm/°C; Part Number: RMCF0402FT4K70; ComponentLink1Description: Datasheet; ComponentLink1URL: https://www.seielect.com/catalog/sei-packaging.pdf; ComponentLink2Description: DigiKey Link; ComponentLink2URL: https://www.digikey.com/en/products/detail/stackpole-electronics-inc/RMCF0402FT4K70/1761370; Composition: Thick Film; Device Package: 0402 (1005 Metric); Features: Automotive AEC-Q200; Height - Seated (Max): 0.016" (0.40mm); LastUpdated: 7/10/2022 9:14:59 AM; Lifecycle Status: Active; Minimum Order: 1; Number of Terminations: 2; Operating Temperature: -55°C ~ 155°C; Package / Case: 0402 (1005 Metric); Packaging: CutTape; PartId: 4917; Part Status: Active; Price: 0.01; Ratings: AEC-Q200; Resistance: 4.7 kOhms; Series: RMCF; Size / Dimension: 0.039" L x 0.020" W (1.00mm x 0.50mm); Supplier 1: DigiKey; Supplier Part Number 1: RMCF0402FT4K70CT-ND; Supplier Device Package: 0402; Tolerance: ±1%
R5 = RK73H1ETTP1001F: RES 1K OHM 1% 1/10W 0402; Manufacturer: KOA Speer Electronics, Inc.; Power (Watts): 0.1W, 1/10W; Resistance: 1 kOhms; Temperature Coefficient: ±100ppm/°C; Part Number: RK73H1ETTP1001F; ComponentLink1Description: Datasheet; ComponentLink1URL: http://www.koaspeer.com/catimages/Products/RK73H/RK73H.pdf; ComponentLink2Description: DigiKey Link; ComponentLink2URL: https://www.digikey.com/en/products/detail/koa-speer-electronics-inc/RK73H1ETTP1001F/9844155; Composition: Thick Film; Device Package: 0402 (1005 Metric); Features: Automotive AEC-Q200, Moisture Resistant; Height - Seated (Max): 0.016" (0.40mm); LastUpdated: 7/15/2022 11:42:29 AM; Lifecycle Status: Active; Minimum Order: 1; Number of Terminations: 2; Operating Temperature: -55°C ~ 155°C; Package / Case: 0402 (1005 Metric); Packaging: CutTape; PartId: 16007; Part Status: Active; Price: 0.01; Ratings: AEC-Q200; Series: RK73H; Size / Dimension: 0.039" L x 0.020" W (1.00mm x 0.50mm); Supplier 1: DigiKey; Supplier Part Number 1: 2019-RK73H1ETTP1001FCT-ND; Supplier Device Package: 0402; Tolerance: ±1%
R6 R9 R12 R20-R23 = RCA0402100RFKED: RES SMD 100 OHM 1% 1/16W 0402; Manufacturer: Vishay Dale; Value: 100 Ohms; Power (Watts): 0.063W, 1/16W; Temperature Coefficient: ±100ppm/°C; Part Number: RCA0402100RFKED; ComponentLink1Description: Datasheet; ComponentLink1URL: http://www.vishay.com/docs/20037/rcae3.pdf; ComponentLink2Description: DigiKey Link; ComponentLink2URL: http://digikey.com/product-detail/en/vishay-dale/RCA0402100RFKED/541-2177-1-ND/4946830; Composition: Thick Film; Device Package: 0402 (1005 Metric); Features: Anti-Sulfur, Automotive AEC-Q200; Height - Seated (Max): 0.016" (0.40mm); LastUpdated: 7/10/2022 9:15:04 AM; Lifecycle Status: Active; Minimum Order: 1; Number of Terminations: 2; Operating Temperature: -55°C ~ 155°C; Package / Case: 0402 (1005 Metric); Packaging: TapeAndReel; PartId: 3179; Part Status: Active; Price: 0.01; Ratings: AEC-Q200; Resistance: 100 Ohms; Series: RCA; Size / Dimension: 0.039" L x 0.020" W (1.00mm x 0.50mm); Supplier 1: DigiKey; Supplier Part Number 1: 541-2177-1-ND; Supplier Device Package: 0402; Tolerance: ±1%
R8 = RC0402FR-0784R5L: RES 84.5 OHM 1% 1/16W 0402; Manufacturer: Yageo; Power (Watts): 0.063W, 1/16W; Resistance: 84.5 Ohms; Temperature Coefficient: ±100ppm/°C; Part Number: RC0402FR-0784R5L; ComponentLink1Description: Datasheet; ComponentLink1URL: https://www.yageo.com/upload/media/product/productsearch/datasheet/rchip/PYu-RC_Group_51_RoHS_L_10.pdf; ComponentLink2Description: DigiKey Link; ComponentLink2URL: https://www.digikey.com/en/products/detail/yageo/RC0402FR-0784R5L/5281106; Composition: Thick Film; Device Package: 0402 (1005 Metric); Features: Moisture Resistant; Height - Seated (Max): 0.016" (0.40mm); LastUpdated: 7/15/2022 11:42:18 AM; Lifecycle Status: Active; Minimum Order: 1; Number of Terminations: 2; Operating Temperature: -55°C ~ 155°C; Package / Case: 0402 (1005 Metric); Packaging: CutTape; PartId: 18988; Part Status: Active; Price: 0.01; Series: RC_L; Size / Dimension: 0.039" L x 0.020" W (1.00mm x 0.50mm); Supplier 1: DigiKey; Supplier Part Number 1: YAG3246CT-ND; Supplier Device Package: 0402; Tolerance: ±1%
R11 = RN73R1ETTP1450B25: RES 145 OHM 0.1% 1/16W 0402; Manufacturer: KOA Speer Electronics, Inc.; Power (Watts): 0.063W, 1/16W; Resistance: 145 Ohms; Temperature Coefficient: ±25ppm/°C; Part Number: RN73R1ETTP1450B25; ComponentLink1Description: Datasheet; ComponentLink1URL: https://media.digikey.com/pdf/Data%20Sheets/KOA%20Speer/RN73R_Type_DS.pdf; ComponentLink2Description: DigiKey Link; ComponentLink2URL: https://www.digikey.com/en/products/detail/koa-speer-electronics-inc/RN73R1ETTP1450B25/10000862; Composition: Thin Film; Device Package: 0402 (1005 Metric); Features: Automotive AEC-Q200, Moisture Resistant; Height - Seated (Max): 0.016" (0.40mm); LastUpdated: 7/15/2022 11:41:49 AM; Lifecycle Status: Active; Minimum Order: 1; Number of Terminations: 2; Operating Temperature: -55°C ~ 155°C; Package / Case: 0402 (1005 Metric); Packaging: TapeAndReel; PartId: 64883; Part Status: Active; Price: 0.06; Ratings: AEC-Q200; Series: RN73R; Size / Dimension: 0.039" L x 0.020" W (1.00mm x 0.50mm); Supplier 1: DigiKey; Supplier Part Number 1: 2019-RN73R1ETTP1450B25CT-ND; Supplier Device Package: 0402; Tolerance: ±0.1%
R14 = RMCF0402FT90R9: RES 90.9 OHM 1% 1/16W 0402; Manufacturer: Stackpole Electronics Inc; Power (Watts): 0.063W, 1/16W; Resistance: 90.9 Ohms; Temperature Coefficient: ±100ppm/°C; Part Number: RMCF0402FT90R9; ComponentLink1Description: Datasheet; ComponentLink1URL: https://www.seielect.com/catalog/sei-rmcf_rmcp.pdf; ComponentLink2Description: DigiKey Link; ComponentLink2URL: https://www.digikey.com/en/products/detail/stackpole-electronics-inc/RMCF0402FT90R9/1761634; Composition: Thick Film; Device Package: 0402 (1005 Metric); Features: Automotive AEC-Q200; Height - Seated (Max): 0.016" (0.40mm); LastUpdated: 7/15/2022 11:42:31 AM; Lifecycle Status: Active; Minimum Order: 1; Number of Terminations: 2; Operating Temperature: -55°C ~ 155°C; Package / Case: 0402 (1005 Metric); Packaging: CutTape; PartId: 15568; Part Status: Active; Price: 0.01; Ratings: AEC-Q200; Series: RMCF; Size / Dimension: 0.039" L x 0.020" W (1.00mm x 0.50mm); Supplier 1: DigiKey; Supplier Part Number 1: RMCF0402FT90R9CT-ND; Supplier Device Package: 0402; Tolerance: ±1%
R16 R17 R19 = RC0402FR-071K8L: RES 1.8K OHM 1% 1/16W 0402; Manufacturer: Yageo; Value: 1.8 kOhms; Power (Watts): 0.063W, 1/16W; Temperature Coefficient: ±100ppm/°C; Part Number: RC0402FR-071K8L; ComponentLink1Description: Datasheet; ComponentLink1URL: https://www.yageo.com/upload/media/product/productsearch/datasheet/rchip/PYu-RC_Group_51_RoHS_L_10.pdf; ComponentLink2Description: DigiKey Link; ComponentLink2URL: https://www.digikey.com/en/products/detail/yageo/RC0402FR-071K8L/726520; Composition: Thick Film; Device Package: 0402 (1005 Metric); Features: Moisture Resistant; Height - Seated (Max): 0.016" (0.40mm); LastUpdated: 7/10/2022 9:15:06 AM; Lifecycle Status: Active; Minimum Order: 1; Number of Terminations: 2; Operating Temperature: -55°C ~ 155°C; Package / Case: 0402 (1005 Metric); Packaging: CutTape; PartId: 2542; Part Status: Active; Price: 0.01; Resistance: 1.8 kOhms; Series: RC_L; Size / Dimension: 0.039" L x 0.020" W (1.00mm x 0.50mm); Supplier 1: DigiKey; Supplier Part Number 1: 311-1.80KLRCT-ND; Supplier Device Package: 0402; Tolerance: ±1%
R24 = CRCW06031K00FKEB: RES SMD 1K OHM 1% 1/10W 0603; Manufacturer: Vishay Dale; Value: 1 kOhms; Power (Watts): 0.1W, 1/10W; Temperature Coefficient: ±100ppm/°C; Part Number: CRCW06031K00FKEB; ComponentLink1Description: Datasheet; ComponentLink1URL: http://www.vishay.com/docs/20035/dcrcwe3.pdf; ComponentLink2Description: DigiKey Link; ComponentLink2URL: http://digikey.com/product-detail/en/vishay-dale/CRCW06031K00FKEB/541-2985-1-ND/6073628; Composition: Thick Film; Device Package: 0603 (1608 Metric); Features: Automotive AEC-Q200; Height - Seated (Max): 0.020" (0.50mm); LastUpdated: 7/10/2022 9:22:37 AM; Lifecycle Status: Active; Minimum Order: 1; Number of Terminations: 2; Operating Temperature: -55°C ~ 155°C; Package / Case: 0603 (1608 Metric); Packaging: CutTape; PartId: 5123; Part Status: Active; Price: 0.10; Ratings: AEC-Q200; Resistance: 1 kOhms; Series: CRCW; Size / Dimension: 0.063" L x 0.033" W (1.60mm x 0.85mm); Supplier 1: DigiKey; Supplier Part Number 1: 541-2985-1-ND; Supplier Device Package: 0603; Tolerance: ±1%
S1 = UL
S2 = RoHS
S3 = 34EngineeringLogo: 34 Engineering Silkscreen Logo
U1 = CMP-0383-00028-1: Artix-7 FPGA, 170 User I/Os, 0 GTP, 256-Ball BGA, Speed Grade 1, Commercial Grade, Pb-Free; Manufacturer: Xilinx; Speed Grades: 1; Total Block RAM: 1800 Kb; CMTs: 5; GTP: 0; Available User I/O: 170; Logic Cells: 33280; ComponentLink2Description: Datasheet; ComponentLink2URL: http://www.xilinx.com/support/documentation/data_sheets/ds180_7Series_Overview.pdf; ComponentLink1Description: Manufacturer URL; Operating Temperature Range: Commercial; PackageVersion: Rev. 1.11; ComponentLink4URL: http://www.xilinx.com/support/documentation/user_guides/ug475_7Series_Pkg_Pinout.pdf; ComponentLink4Description: Package Specification; PackageDescription: 256-Ball Wire-Bond Fine-Pitch Thin BGA, Body 17 x 17 mm, Pitch 1 mm; Mounting Technology: Surface Mount; ComponentLink1URL: http://www.xilinx.com/; Maximum Distributed RAM: 400 Kb; PackageReference: FTG-256; DatasheetVersion: Rev. 1.15; ComponentLink3Description: Pinout; PartNumber: XC7A35T-1FTG256C; ComponentLink3URL: http://www.xilinx.com/support/documentation/user_guides/ug475_7Series_Pkg_Pinout.pdf
U2 = CAT93C46BHU4I-GT3: EEPROM Memory IC 1Kb (128 x 8, 64 x 16) SPI 4 MHz 8-UDFN-EP (2x3); ComponentLink1URL: http://www.onsemi.com/pub_link/Collateral/CAT93C46B-D.PDF?src-supplier=Avnet; ComponentLink1Description: http://www.onsemi.com/pub_link/Collateral/CAT93C46B-D.PDF?src-supplier=Avnet; ComponentLink2URL: http://www.onsemi.com/pub/Collateral/CAT93C46B-D.PDF?src-supplier=Digi-Key; ComponentLink2Description: http://www.onsemi.com/pub/Collateral/CAT93C46B-D.PDF?src-supplier=Digi-Key; Supplier 1: Arrow Electronics; Supplier Part Number 1: CAT93C46BHU4I-GT3
U3 = CMP-78876-000010-1: IC FLASH 16MBIT SPI/QUAD 8WSON; Frequency: 133MHz; Memory Size: 16Mb; Memory Type: Non-Volatile; Packaging: Rail/Tube; Mount: Surface Mount; Min Operating Temperature: -40°C; Max Operating Temperature: 85°C
X1 = SIT8008AI-11-XXE-100.000000: Oscillator MEMS 100MHz ±20ppm (Stability) 15pF HCMOS/LVCMOS 55% 2.5V/2.8V/3V/3.3V Medical 4-Pin QFN SMD T/R; Manufacturer: SiTime; Manufacturer Part Number: SIT8008AI-11-XXE-100.000000E; Max Supply Current: 4.5mA; Supplier 1: Avnet; RoHS: Yes; Category: Oscillators; Pricing 1: 1000=0.93600, 2000=0.91104, 4000=0.88608, 6000=0.86112, 8000=0.83616 (USD); Mount: Surface Mount; Case/Package: SMD/SMT; Min Operating Temperature: -40°C; Max Operating Temperature: 85°C; Packaging: Tape and Reel; Frequency: 100MHz; Frequency Stability: 20ppm; RoHS Compliant: Yes; ComponentLink1URL: https://media.digikey.com/pdf/Data%20Sheets/SiTime%20PDFs/New_Rev_FAQ.pdf?src-supplier=Digi-Key; ComponentLink1Description: https://media.digikey.com/pdf/Data%20Sheets/SiTime%20PDFs/New_Rev_FAQ.pdf?src-supplier=Digi-Key; Supplier Part Number 1: SIT8008AI-11-XXE-100.000000E